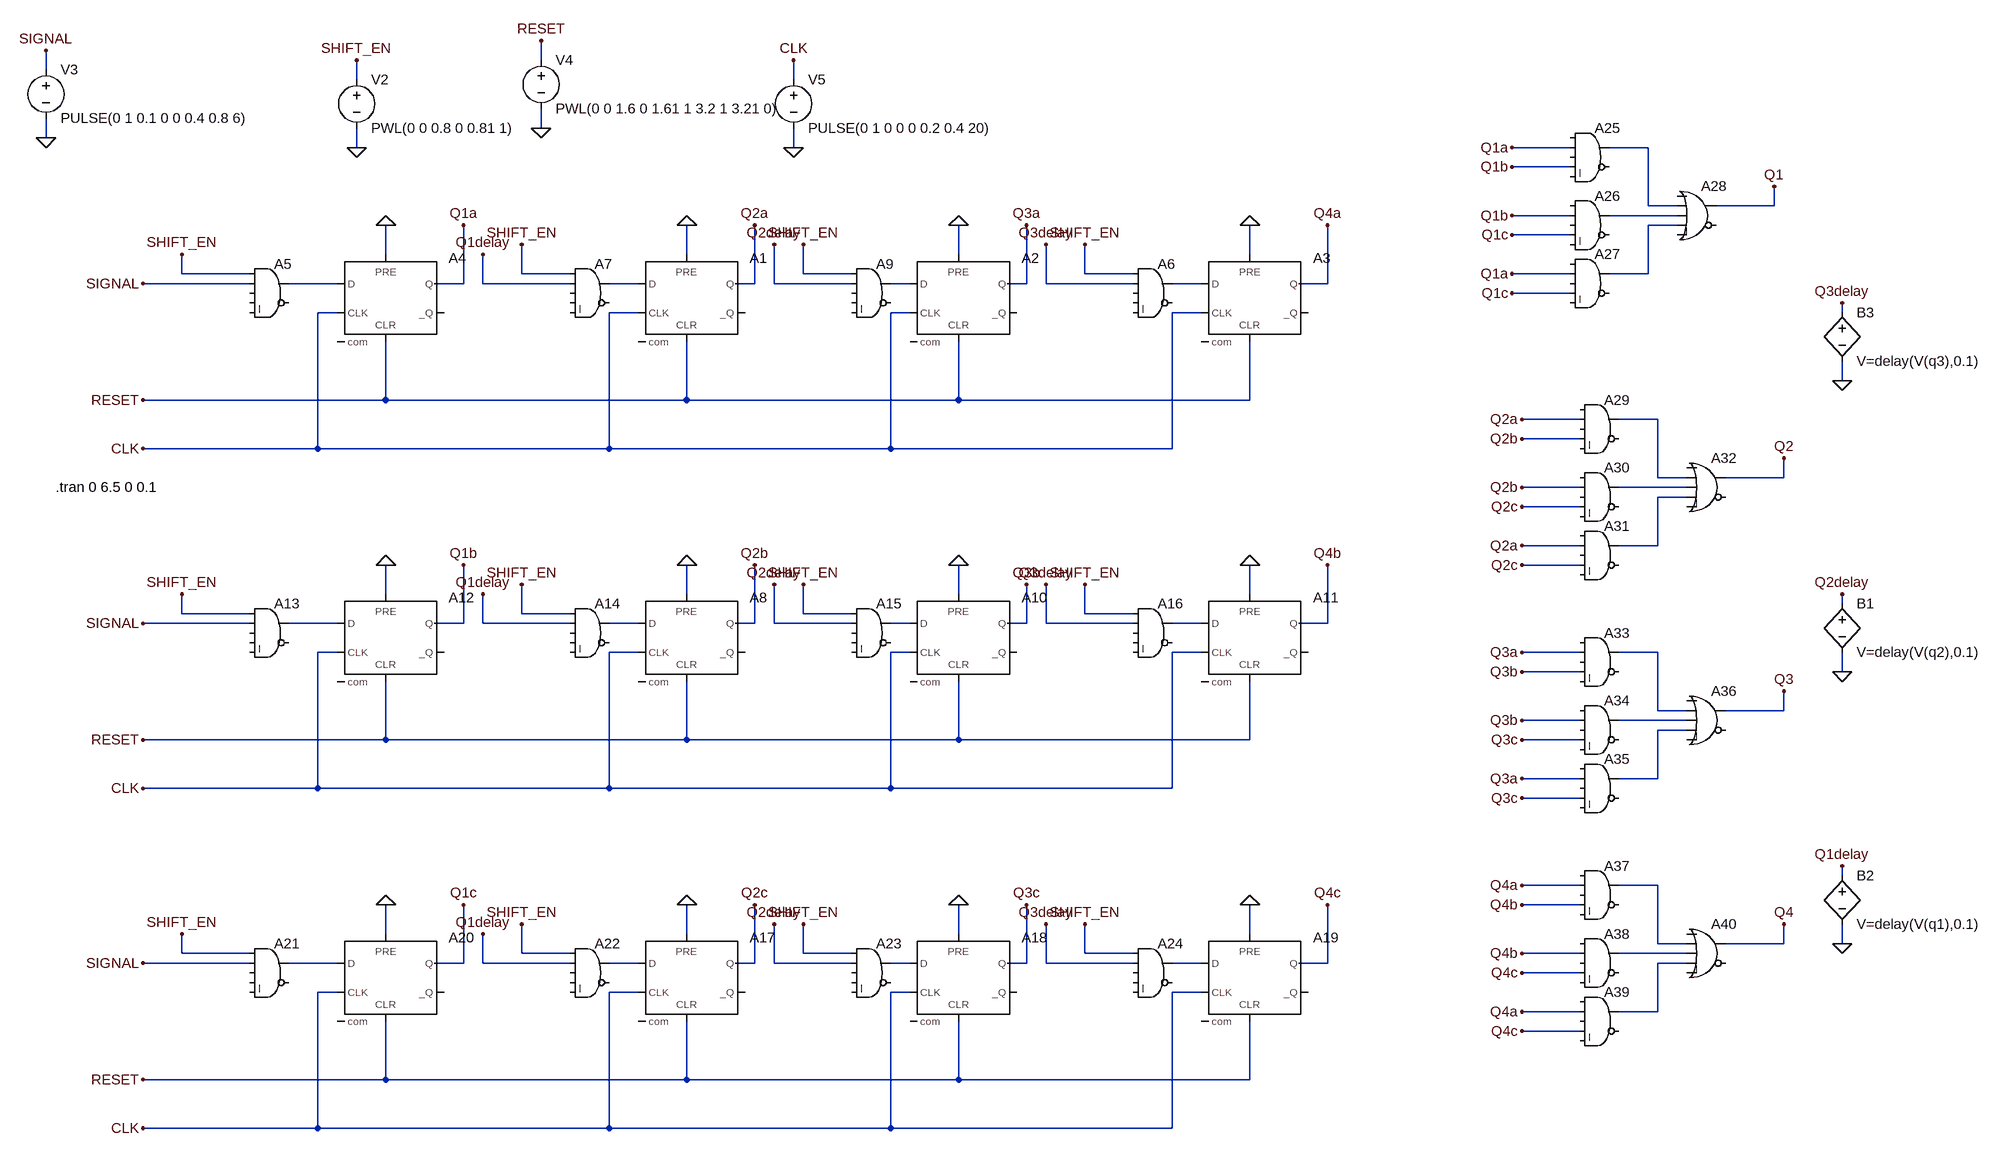
[diagram p0: schematic shiftReg.asc]
shiftReg.asc, the LTspice schematic file:
Version 4
SHEET 1 2564 1040
WIRE -352 -1072 -352 -1104
WIRE -1168 -1056 -1168 -1088
WIRE -656 -1040 -656 -1072
WIRE 64 -1040 64 -1072
WIRE -352 -960 -352 -992
WIRE -1168 -944 -1168 -976
WIRE -656 -928 -656 -960
WIRE 64 -928 64 -960
WIRE 1344 -928 1248 -928
WIRE 1472 -928 1408 -928
WIRE 1344 -896 1248 -896
WIRE 1472 -832 1472 -928
WIRE 1520 -832 1472 -832
WIRE 1680 -832 1680 -864
WIRE 1680 -832 1584 -832
WIRE 1344 -816 1248 -816
WIRE 1520 -816 1408 -816
WIRE 1520 -800 1472 -800
WIRE 1344 -784 1248 -784
WIRE -608 -752 -608 -800
WIRE -112 -752 -112 -800
WIRE 336 -752 336 -800
WIRE 816 -752 816 -800
WIRE -944 -720 -944 -752
WIRE -832 -720 -944 -720
WIRE -384 -720 -384 -768
WIRE -304 -720 -384 -720
WIRE 80 -720 80 -768
WIRE 160 -720 80 -720
WIRE 544 -720 544 -768
WIRE 624 -720 544 -720
WIRE 1344 -720 1248 -720
WIRE 1472 -720 1472 -800
WIRE 1472 -720 1408 -720
WIRE -832 -704 -1008 -704
WIRE -688 -704 -768 -704
WIRE -480 -704 -480 -800
WIRE -480 -704 -528 -704
WIRE -448 -704 -448 -752
WIRE -304 -704 -448 -704
WIRE -192 -704 -240 -704
WIRE 0 -704 0 -800
WIRE 0 -704 -32 -704
WIRE 32 -704 32 -768
WIRE 160 -704 32 -704
WIRE 256 -704 224 -704
WIRE 448 -704 448 -800
WIRE 448 -704 416 -704
WIRE 480 -704 480 -768
WIRE 624 -704 480 -704
WIRE 736 -704 688 -704
WIRE 944 -704 944 -800
WIRE 944 -704 896 -704
WIRE 1344 -688 1248 -688
WIRE -688 -656 -720 -656
WIRE -192 -656 -240 -656
WIRE 256 -656 224 -656
WIRE 736 -656 688 -656
WIRE 1792 -656 1792 -672
WIRE 1792 -544 1792 -576
WIRE -608 -512 -608 -608
WIRE -608 -512 -1008 -512
WIRE -112 -512 -112 -608
WIRE -112 -512 -608 -512
WIRE 336 -512 336 -608
WIRE 336 -512 -112 -512
WIRE 816 -512 816 -608
WIRE 816 -512 336 -512
WIRE 1360 -480 1264 -480
WIRE 1488 -480 1424 -480
WIRE 1360 -448 1264 -448
WIRE -720 -432 -720 -656
WIRE -720 -432 -1008 -432
WIRE -240 -432 -240 -656
WIRE -240 -432 -720 -432
WIRE 224 -432 224 -656
WIRE 224 -432 -240 -432
WIRE 688 -432 688 -656
WIRE 688 -432 224 -432
WIRE 1488 -384 1488 -480
WIRE 1536 -384 1488 -384
WIRE 1696 -384 1696 -416
WIRE 1696 -384 1600 -384
WIRE 1360 -368 1264 -368
WIRE 1536 -368 1424 -368
WIRE 1536 -352 1488 -352
WIRE 1360 -336 1264 -336
WIRE 1360 -272 1264 -272
WIRE 1488 -272 1488 -352
WIRE 1488 -272 1424 -272
WIRE 1360 -240 1264 -240
WIRE -608 -192 -608 -240
WIRE -112 -192 -112 -240
WIRE 336 -192 336 -240
WIRE 816 -192 816 -240
WIRE 1792 -176 1792 -192
WIRE -944 -160 -944 -192
WIRE -832 -160 -944 -160
WIRE -384 -160 -384 -208
WIRE -304 -160 -384 -160
WIRE 80 -160 80 -208
WIRE 160 -160 80 -160
WIRE 544 -160 544 -208
WIRE 624 -160 544 -160
WIRE -832 -144 -1008 -144
WIRE -688 -144 -768 -144
WIRE -480 -144 -480 -240
WIRE -480 -144 -528 -144
WIRE -448 -144 -448 -192
WIRE -304 -144 -448 -144
WIRE -192 -144 -240 -144
WIRE 0 -144 0 -240
WIRE 0 -144 -32 -144
WIRE 32 -144 32 -208
WIRE 160 -144 32 -144
WIRE 256 -144 224 -144
WIRE 448 -144 448 -208
WIRE 448 -144 416 -144
WIRE 480 -144 480 -208
WIRE 624 -144 480 -144
WIRE 736 -144 688 -144
WIRE 944 -144 944 -240
WIRE 944 -144 896 -144
WIRE -688 -96 -720 -96
WIRE -192 -96 -240 -96
WIRE 256 -96 224 -96
WIRE 736 -96 688 -96
WIRE 1360 -96 1264 -96
WIRE 1488 -96 1424 -96
WIRE 1360 -64 1264 -64
WIRE 1792 -64 1792 -96
WIRE 1488 0 1488 -96
WIRE 1536 0 1488 0
WIRE 1696 0 1696 -32
WIRE 1696 0 1600 0
WIRE 1360 16 1264 16
WIRE 1536 16 1424 16
WIRE 1536 32 1488 32
WIRE -608 48 -608 -48
WIRE -608 48 -1008 48
WIRE -112 48 -112 -48
WIRE -112 48 -608 48
WIRE 336 48 336 -48
WIRE 336 48 -112 48
WIRE 816 48 816 -48
WIRE 816 48 336 48
WIRE 1360 48 1264 48
WIRE 1360 112 1264 112
WIRE 1488 112 1488 32
WIRE 1488 112 1424 112
WIRE -720 128 -720 -96
WIRE -720 128 -1008 128
WIRE -240 128 -240 -96
WIRE -240 128 -720 128
WIRE 224 128 224 -96
WIRE 224 128 -240 128
WIRE 688 128 688 -96
WIRE 688 128 224 128
WIRE 1360 144 1264 144
WIRE 1792 272 1792 256
WIRE 1360 288 1264 288
WIRE 1488 288 1424 288
WIRE 1360 320 1264 320
WIRE -608 368 -608 320
WIRE -112 368 -112 320
WIRE 336 368 336 320
WIRE 816 368 816 320
WIRE 1488 384 1488 288
WIRE 1536 384 1488 384
WIRE 1696 384 1696 352
WIRE 1696 384 1600 384
WIRE 1792 384 1792 352
WIRE -944 400 -944 368
WIRE -832 400 -944 400
WIRE -384 400 -384 352
WIRE -304 400 -384 400
WIRE 80 400 80 352
WIRE 160 400 80 400
WIRE 544 400 544 352
WIRE 624 400 544 400
WIRE 1360 400 1264 400
WIRE 1536 400 1424 400
WIRE -832 416 -1008 416
WIRE -688 416 -768 416
WIRE -480 416 -480 320
WIRE -480 416 -528 416
WIRE -448 416 -448 368
WIRE -304 416 -448 416
WIRE -192 416 -240 416
WIRE 0 416 0 320
WIRE 0 416 -32 416
WIRE 32 416 32 352
WIRE 160 416 32 416
WIRE 256 416 224 416
WIRE 448 416 448 320
WIRE 448 416 416 416
WIRE 480 416 480 352
WIRE 624 416 480 416
WIRE 736 416 688 416
WIRE 944 416 944 320
WIRE 944 416 896 416
WIRE 1536 416 1488 416
WIRE 1360 432 1264 432
WIRE -688 464 -720 464
WIRE -192 464 -240 464
WIRE 256 464 224 464
WIRE 736 464 688 464
WIRE 1360 496 1264 496
WIRE 1488 496 1488 416
WIRE 1488 496 1424 496
WIRE 1360 528 1264 528
WIRE -608 608 -608 512
WIRE -608 608 -1008 608
WIRE -112 608 -112 512
WIRE -112 608 -608 608
WIRE 336 608 336 512
WIRE 336 608 -112 608
WIRE 816 608 816 512
WIRE 816 608 336 608
WIRE -720 688 -720 464
WIRE -720 688 -1008 688
WIRE -240 688 -240 464
WIRE -240 688 -720 688
WIRE 224 688 224 464
WIRE 224 688 -240 688
WIRE 688 688 688 464
WIRE 688 688 224 688
FLAG -112 -800 0
FLAG -480 -800 Q1a
FLAG 0 -800 Q2a
FLAG 448 -800 Q3a
FLAG 944 -800 Q4a
FLAG -608 -800 0
FLAG 336 -800 0
FLAG 816 -800 0
FLAG -656 -928 0
FLAG -1168 -944 0
FLAG -352 -960 0
FLAG 64 -928 0
FLAG -656 -1072 SHIFT_EN
FLAG -1168 -1088 SIGNAL
FLAG -352 -1104 RESET
FLAG 64 -1072 CLK
FLAG -944 -752 SHIFT_EN
FLAG -1008 -512 RESET
FLAG -1008 -432 CLK
FLAG -1008 -704 SIGNAL
FLAG -384 -768 SHIFT_EN
FLAG 80 -768 SHIFT_EN
FLAG 544 -768 SHIFT_EN
FLAG 1792 -64 0
FLAG 1792 -192 Q2delay
FLAG 1792 384 0
FLAG 1792 256 Q1delay
FLAG 1792 -544 0
FLAG 1792 -672 Q3delay
FLAG -448 -752 Q1delay
FLAG 32 -768 Q2delay
FLAG 480 -768 Q3delay
FLAG -112 -240 0
FLAG -480 -240 Q1b
FLAG 0 -240 Q2b
FLAG 944 -240 Q4b
FLAG -608 -240 0
FLAG 336 -240 0
FLAG 816 -240 0
FLAG -944 -192 SHIFT_EN
FLAG -1008 48 RESET
FLAG -1008 128 CLK
FLAG -1008 -144 SIGNAL
FLAG -384 -208 SHIFT_EN
FLAG 80 -208 SHIFT_EN
FLAG 544 -208 SHIFT_EN
FLAG -448 -192 Q1delay
FLAG 32 -208 Q2delay
FLAG 480 -208 Q3delay
FLAG -112 320 0
FLAG -480 320 Q1c
FLAG 0 320 Q2c
FLAG 448 320 Q3c
FLAG 944 320 Q4c
FLAG -608 320 0
FLAG 336 320 0
FLAG 816 320 0
FLAG -944 368 SHIFT_EN
FLAG -1008 608 RESET
FLAG -1008 688 CLK
FLAG -1008 416 SIGNAL
FLAG -384 352 SHIFT_EN
FLAG 80 352 SHIFT_EN
FLAG 544 352 SHIFT_EN
FLAG -448 368 Q1delay
FLAG 32 352 Q2delay
FLAG 480 352 Q3delay
FLAG 1680 -864 Q1
FLAG 1248 -928 Q1a
FLAG 1248 -720 Q1a
FLAG 1248 -896 Q1b
FLAG 1248 -688 Q1c
FLAG 1248 -816 Q1b
FLAG 1248 -784 Q1c
FLAG 1696 -416 Q2
FLAG 1264 -480 Q2a
FLAG 1264 -272 Q2a
FLAG 1264 -448 Q2b
FLAG 1264 -240 Q2c
FLAG 1264 -368 Q2b
FLAG 1264 -336 Q2c
FLAG 1696 -32 Q3
FLAG 1264 -96 Q3a
FLAG 1264 112 Q3a
FLAG 1264 -64 Q3b
FLAG 1264 144 Q3c
FLAG 1264 16 Q3b
FLAG 1264 48 Q3c
FLAG 1696 352 Q4
FLAG 1264 288 Q4a
FLAG 1264 496 Q4a
FLAG 1264 320 Q4b
FLAG 1264 528 Q4c
FLAG 1264 400 Q4b
FLAG 1264 432 Q4c
FLAG 448 -208 Q3b
SYMBOL Digital\\dflop -112 -752 R0
SYMATTR InstName A1
SYMBOL Digital\\dflop 336 -752 R0
SYMATTR InstName A2
SYMBOL Digital\\dflop 816 -752 R0
SYMATTR InstName A3
SYMBOL Digital\\dflop -608 -752 R0
SYMATTR InstName A4
SYMBOL voltage -656 -1056 R0
WINDOW 123 0 0 Left 2
WINDOW 39 0 0 Left 2
SYMATTR InstName V2
SYMATTR Value PWL(0 0 0.8 0 0.81 1)
SYMBOL voltage -1168 -1072 R0
WINDOW 123 0 0 Left 2
WINDOW 39 0 0 Left 2
SYMATTR InstName V3
SYMATTR Value PULSE(0 1 0.1 0 0 0.4 0.8 6)
SYMBOL voltage -352 -1088 R0
WINDOW 123 0 0 Left 2
WINDOW 39 0 0 Left 2
SYMATTR InstName V4
SYMATTR Value PWL(0 0 1.6 0 1.61 1 3.2 1 3.21 0)
SYMBOL Digital\\and -800 -752 R0
SYMATTR InstName A5
SYMBOL voltage 64 -1056 R0
WINDOW 123 0 0 Left 2
WINDOW 39 0 0 Left 2
SYMATTR InstName V5
SYMATTR Value PULSE(0 1 0 0 0 0.2 0.4 20)
SYMBOL Digital\\and -272 -752 R0
SYMATTR InstName A7
SYMBOL Digital\\and 192 -752 R0
SYMATTR InstName A9
SYMBOL Digital\\and 656 -752 R0
SYMATTR InstName A6
SYMBOL bv 1792 -192 R0
SYMATTR InstName B1
SYMATTR Value V=delay(V(q2),0.1)
SYMBOL bv 1792 256 R0
SYMATTR InstName B2
SYMATTR Value V=delay(V(q1),0.1)
SYMBOL bv 1792 -672 R0
SYMATTR InstName B3
SYMATTR Value V=delay(V(q3),0.1)
SYMBOL Digital\\dflop -112 -192 R0
SYMATTR InstName A8
SYMBOL Digital\\dflop 336 -192 R0
SYMATTR InstName A10
SYMBOL Digital\\dflop 816 -192 R0
SYMATTR InstName A11
SYMBOL Digital\\dflop -608 -192 R0
SYMATTR InstName A12
SYMBOL Digital\\and -800 -192 R0
SYMATTR InstName A13
SYMBOL Digital\\and -272 -192 R0
SYMATTR InstName A14
SYMBOL Digital\\and 192 -192 R0
SYMATTR InstName A15
SYMBOL Digital\\and 656 -192 R0
SYMATTR InstName A16
SYMBOL Digital\\dflop -112 368 R0
SYMATTR InstName A17
SYMBOL Digital\\dflop 336 368 R0
SYMATTR InstName A18
SYMBOL Digital\\dflop 816 368 R0
SYMATTR InstName A19
SYMBOL Digital\\dflop -608 368 R0
SYMATTR InstName A20
SYMBOL Digital\\and -800 368 R0
SYMATTR InstName A21
SYMBOL Digital\\and -272 368 R0
SYMATTR InstName A22
SYMBOL Digital\\and 192 368 R0
SYMATTR InstName A23
SYMBOL Digital\\and 656 368 R0
SYMATTR InstName A24
SYMBOL Digital\\and 1376 -976 R0
SYMATTR InstName A25
SYMBOL Digital\\and 1376 -864 R0
SYMATTR InstName A26
SYMBOL Digital\\and 1376 -768 R0
SYMATTR InstName A27
SYMBOL Digital\\or 1552 -880 R0
SYMATTR InstName A28
SYMBOL Digital\\and 1392 -528 R0
SYMATTR InstName A29
SYMBOL Digital\\and 1392 -416 R0
SYMATTR InstName A30
SYMBOL Digital\\and 1392 -320 R0
SYMATTR InstName A31
SYMBOL Digital\\or 1568 -432 R0
SYMATTR InstName A32
SYMBOL Digital\\and 1392 -144 R0
SYMATTR InstName A33
SYMBOL Digital\\and 1392 -32 R0
SYMATTR InstName A34
SYMBOL Digital\\and 1392 64 R0
SYMATTR InstName A35
SYMBOL Digital\\or 1568 -48 R0
SYMATTR InstName A36
SYMBOL Digital\\and 1392 240 R0
SYMATTR InstName A37
SYMBOL Digital\\and 1392 352 R0
SYMATTR InstName A38
SYMBOL Digital\\and 1392 448 R0
SYMATTR InstName A39
SYMBOL Digital\\or 1568 336 R0
SYMATTR InstName A40
TEXT -1152 -368 Left 2 !.tran 0 6.5 0 0.1

The netlist it stands for:
* shiftReg.asc
A1 N005 0 CLK 0 RESET 0 Q2a 0 DFLOP
A2 N006 0 CLK 0 RESET 0 Q3a 0 DFLOP
A3 N007 0 CLK 0 RESET 0 Q4a 0 DFLOP
A4 N004 0 CLK 0 RESET 0 Q1a 0 DFLOP
V2 SHIFT_EN 0 PWL(0 0 0.8 0 0.81 1)
V3 SIGNAL 0 PULSE(0 1 0.1 0 0 0.4 0.8 6)
V4 RESET 0 PWL(0 0 1.6 0 1.61 1 3.2 1 3.21 0)
A5 SHIFT_EN SIGNAL 0 0 0 0 N004 0 AND
V5 CLK 0 PULSE(0 1 0 0 0 0.2 0.4 20)
A7 SHIFT_EN Q1delay 0 0 0 0 N005 0 AND
A9 SHIFT_EN Q2delay 0 0 0 0 N006 0 AND
A6 SHIFT_EN Q3delay 0 0 0 0 N007 0 AND
B1 Q2delay 0 V=delay(V(q2),0.1)
B2 Q1delay 0 V=delay(V(q1),0.1)
B3 Q3delay 0 V=delay(V(q3),0.1)
A8 N012 0 CLK 0 RESET 0 Q2b 0 DFLOP
A10 N013 0 CLK 0 RESET 0 Q3b 0 DFLOP
A11 N014 0 CLK 0 RESET 0 Q4b 0 DFLOP
A12 N011 0 CLK 0 RESET 0 Q1b 0 DFLOP
A13 SHIFT_EN SIGNAL 0 0 0 0 N011 0 AND
A14 SHIFT_EN Q1delay 0 0 0 0 N012 0 AND
A15 SHIFT_EN Q2delay 0 0 0 0 N013 0 AND
A16 SHIFT_EN Q3delay 0 0 0 0 N014 0 AND
A17 N021 0 CLK 0 RESET 0 Q2c 0 DFLOP
A18 N022 0 CLK 0 RESET 0 Q3c 0 DFLOP
A19 N023 0 CLK 0 RESET 0 Q4c 0 DFLOP
A20 N020 0 CLK 0 RESET 0 Q1c 0 DFLOP
A21 SHIFT_EN SIGNAL 0 0 0 0 N020 0 AND
A22 SHIFT_EN Q1delay 0 0 0 0 N021 0 AND
A23 SHIFT_EN Q2delay 0 0 0 0 N022 0 AND
A24 SHIFT_EN Q3delay 0 0 0 0 N023 0 AND
A25 0 Q1a 0 Q1b 0 0 N001 0 AND
A26 0 Q1b 0 Q1c 0 0 N002 0 AND
A27 0 Q1a 0 Q1c 0 0 N003 0 AND
A28 0 N001 N002 N003 0 0 Q1 0 OR
A29 0 Q2a 0 Q2b 0 0 N008 0 AND
A30 0 Q2b 0 Q2c 0 0 N009 0 AND
A31 0 Q2a 0 Q2c 0 0 N010 0 AND
A32 0 N008 N009 N010 0 0 Q2 0 OR
A33 0 Q3a 0 Q3b 0 0 N015 0 AND
A34 0 Q3b 0 Q3c 0 0 N016 0 AND
A35 0 Q3a 0 Q3c 0 0 N017 0 AND
A36 0 N015 N016 N017 0 0 Q3 0 OR
A37 0 Q4a 0 Q4b 0 0 N018 0 AND
A38 0 Q4b 0 Q4c 0 0 N019 0 AND
A39 0 Q4a 0 Q4c 0 0 N024 0 AND
A40 0 N018 N019 N024 0 0 Q4 0 OR
.tran 0 6.5 0 0.1
.backanno
.end